# Altium schematic sheet CATS-EUROC-MCU.SchDoc: CATS EuRoC Edition
size A4; DocumentNumber: Overview; Revision: V1.0; SheetNumber: 2; SheetTotal: 16; Author: Luca Jost; Subtitle: Microcontroller
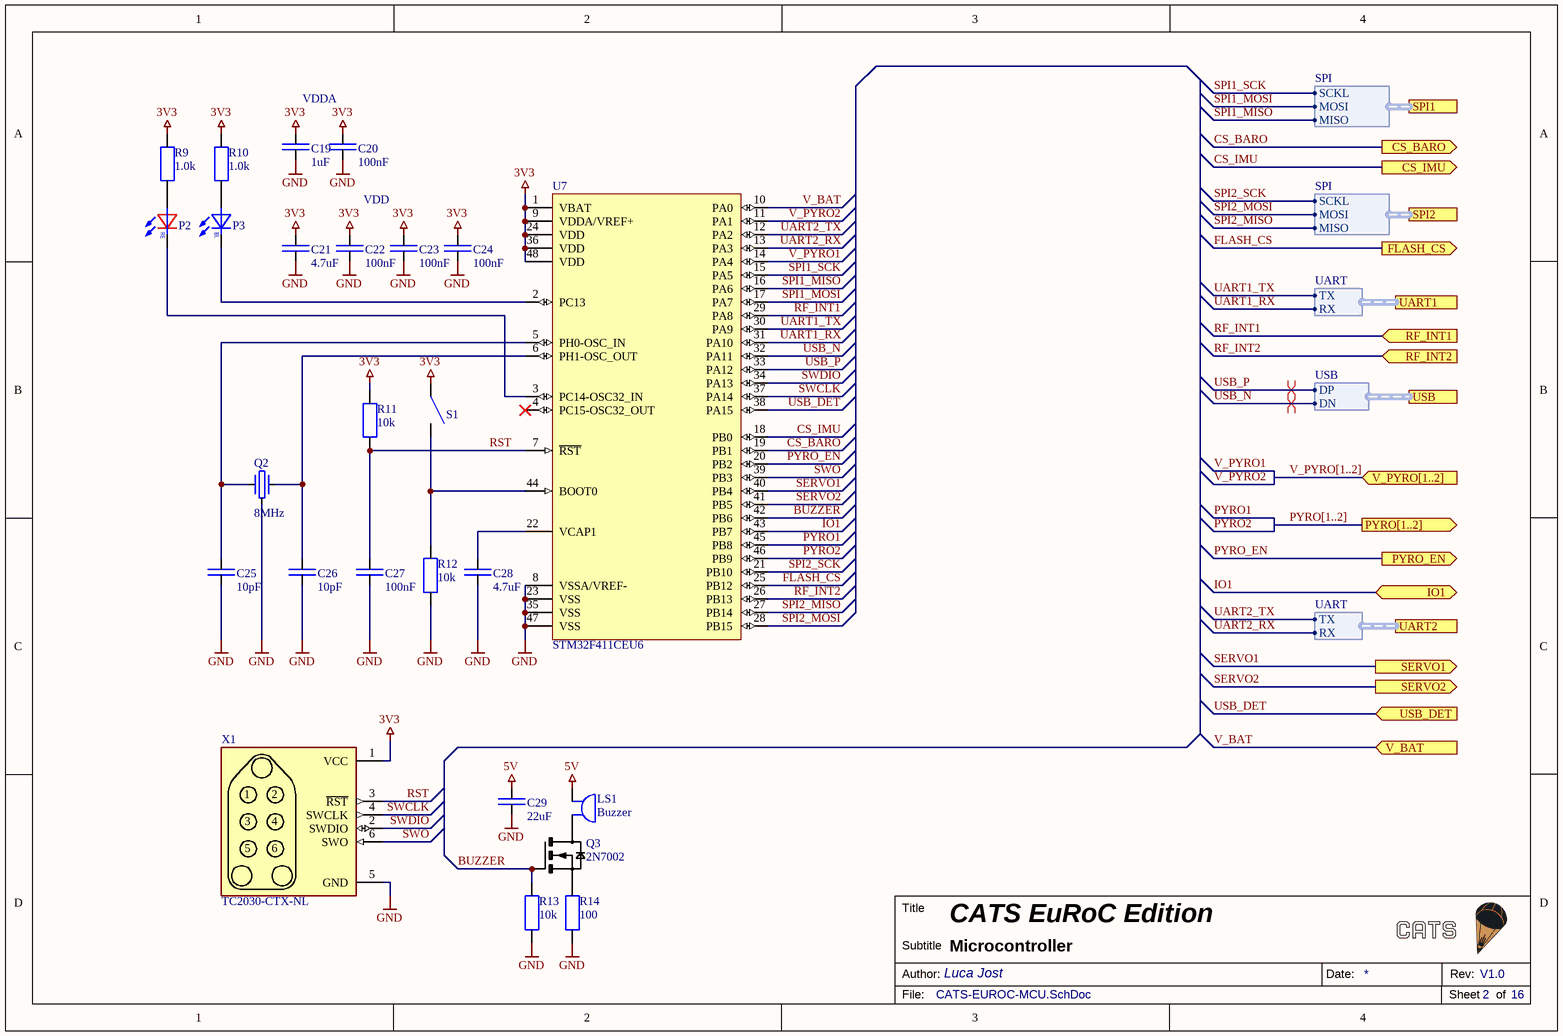
[diagram p0: CATS-EUROC-MCU.SchDoc]

## Parts
C19  1uF  [SMD Keramikkondensator 0402]
C20  100nF  [SMD Keramikkondensator 0402]
C21  4.7uF  [SMD Keramikkondensator 0402]
C22  100nF  [SMD Keramikkondensator 0402]
C23  100nF  [SMD Keramikkondensator 0402]
C24  100nF  [SMD Keramikkondensator 0402]
C25  10pF  [SMD Keramikkondensator 0402]
C26  10pF  [SMD Keramikkondensator 0402]
C27  100nF  [SMD Keramikkondensator 0402]
C28  4.7uF  [SMD Keramikkondensator 0402]
C29  22uF  [SMD Keramikkondensator 0805]
LS1  Buzzer  [SMD BUZZER CMT-8504]
P2  LED  [SMD LED 0603]  (value not drawn)
P3  LED  [SMD LED 0603]  (value not drawn)
Q2  8MHz  [SMD Crystal 3.2X2.5X0.8]
Q3  2N7002  [SMD MOSFET SOT-23]
R9  1.0k  [SMD Widerstand 0402]
R10  1.0k  [SMD Widerstand 0402]
R11  10k  [SMD Widerstand 0402]
R12  10k  [SMD Widerstand 0402]
R13  10k  [SMD Widerstand 0402]
R14  100  [SMD Widerstand 0805]
S1  SMD-Button  [SMD Button 2.5x3x1.2]  (value not drawn)
U7  STM32F411CEU6  [SMD IC QFN-48]
X1  TC2030-CTX-NL  [SMD Connector TC2030]  (no BOM)

## Ports
CS_BARO (out), CS_IMU (out), FLASH_CS (out), IO1 (bidir), PYRO[1..2] (out), PYRO_EN (out), RF_INT1 (in), RF_INT2 (in), SERVO1 (out), SERVO2 (out), SPI1 (harness SPI), SPI2 (harness SPI), UART1 (harness UART), UART2 (harness UART), USB (harness USB), USB_DET (in), V_BAT (in), V_PYRO[1..2] (in)

## Harnesses
SPI: SCKL, MOSI, MISO
UART: TX, RX
USB: DP, DN

## Nets
3V3: C19.2 C20.2 C21.2 C22.2 C23.2 C24.2 R9.2 R10.2 R11.2 S1.1 U7.1(VBAT) U7.9(VDDA/VREF+) U7.24(VDD) U7.36(VDD) U7.48(VDD) X1.1(VCC)
5V: C29.2 LS1.1
GND: C19.1 C20.1 C21.1 C22.1 C23.1 C24.1 C25.1 C26.1 C27.1 C28.1 C29.1 Q2.3 R12.1 R13.1 R14.1 U7.8(VSSA/VREF-) U7.23(VSS) U7.35(VSS) U7.47(VSS) X1.5(GND)
BUZZER: Q3.G R13.2 U7.42(PB6)
CS_BARO: U7.19(PB1) ; port CS_BARO
CS_IMU: U7.18(PB0) ; port CS_IMU
FLASH_CS: U7.25(PB12) ; port FLASH_CS
IO1: U7.43(PB7) ; port IO1
PYRO1: U7.45(PB8)
PYRO2: U7.46(PB9)
PYRO_EN: U7.20(PB2) ; port PYRO_EN
RF_INT1: U7.29(PA8) ; port RF_INT1
RF_INT2: U7.26(PB13) ; port RF_INT2
RST: C27.2 R11.1 U7.7(~{RST}) X1.3(~{RST})
SERVO1: U7.40(PB4) ; port SERVO1
SERVO2: U7.41(PB5) ; port SERVO2
SPI1_MISO: U7.16(PA6) ; port SPI1.MISO
SPI1_MOSI: U7.17(PA7) ; port SPI1.MOSI
SPI1_SCK: U7.15(PA5) ; port SPI1.SCKL
SPI2_MISO: U7.27(PB14) ; port SPI2.MISO
SPI2_MOSI: U7.28(PB15) ; port SPI2.MOSI
SPI2_SCK: U7.21(PB10) ; port SPI2.SCKL
SWCLK: U7.37(PA14) X1.4(SWCLK)
SWDIO: U7.34(PA13) X1.2(SWDIO)
SWO: U7.39(PB3) X1.6(SWO)
UART1_RX: U7.31(PA10) ; port UART1.RX
UART1_TX: U7.30(PA9) ; port UART1.TX
UART2_RX: U7.13(PA3) ; port UART2.RX
UART2_TX: U7.12(PA2) ; port UART2.TX
USB_DET: U7.38(PA15) ; port USB_DET
USB_N: U7.32(PA11) ; port USB.DN
USB_P: U7.33(PA12) ; port USB.DP
V_BAT: U7.10(PA0) ; port V_BAT
V_PYRO1: U7.14(PA4)
V_PYRO2: U7.11(PA1)
NetC25_2: C25.2 Q2.1 U7.5(PH0-OSC_IN)
NetC26_2: C26.2 Q2.2 U7.6(PH1-OSC_OUT)
NetC28_2: C28.2 U7.22(VCAP1)
NetLS1_2: LS1.2 Q3.D
NetP2_A: P2.A R9.1
NetP2_K: P2.K U7.3(PC14-OSC32_IN)
NetP3_A: P3.A R10.1
NetP3_K: P3.K U7.2(PC13)
NetQ3_S: Q3.S R14.2
NetR12_2: R12.2 S1.2 U7.44(BOOT0)

Not connected (* = marked no-connect by the designer): U7 4(PC15-OSC32_OUT)*

## Buses and harness runs
bus PYRO[1..2] = port PYRO[1..2]
bus V_PYRO[1..2] = port V_PYRO[1..2]

## Layout directives
differential pair: USB_N, USB_P

## Notes on the sheet
- VDDA
- VDD
- Title
- Author:
- Subtitle
- Date:
- Rev:
- File:
- Sheet
- of
- (in symbol LED) BL; RE

## Library data of the parts
C19 = E6 - 1uF: SMD Ceramic Capacitor E6; Unit Price: 0.01; Number: -; Supplier: -; JLC: C52923
C20 C22-C24 C27 = E6 - 100nF: SMD Ceramic Capacitor E6; Unit Price: 0.01; Number: -; Supplier: -; JLC: C307331
C21 C28 = E6 - 4.7uF: SMD Ceramic Capacitor E6; Unit Price: 0.01; Number: -; Supplier: -; JLC: C23733
C25 C26 = E6 - 10pF: SMD Ceramic Capacitor E6; Unit Price: 0.01; Number: -; Supplier: -; JLC: C32949
C29 = E6 - 22uF: SMD Ceramic Capacitor E6; Unit Price: 0.01; Number: -; Supplier: -; JLC: C45783
LS1 = Buzzer: Buzzers Indicator, Internally Driven Piezo 12V 10mA 3kHz 100dB @ 12V, 10cm Through Hole PC Pins; Digikey: 2104-IP303012-1-ND; ComponentLink1Description: Datasheet; ComponentLink1URL: https://dbunlimitedco.com/images/product_images/2D-Drawings/IP303012-1.pdf
P2 P3 = LED: Color LED
Q2 = Crystal: SMD Crystal Resonators 8MHz ±10ppm SMD,3.2x2.5mm; Digikey: 535-15255-1-ND; JLC: C2682775
Q3 = 2N7002: MOSFET N-Channel 20V / 115mA; Item Description: N-Channel MOSFET; Digikey: 2N7002NCT-ND; Price: 0.32; ComponentLink1Description: Datasheet; ComponentLink1URL: https://www.onsemi.com/pub/Collateral/NDS7002A-D.PDF; JLC: C15127
R9 R10 = E24 - 1.0k: SMD Chip Resistor E24; Unit Price: 0.01; Number: -; Supplier: -; JLC: C11702
R11-R13 = E24 - 10k: SMD Chip Resistor E24; Unit Price: 0.01; Number: -; Supplier: -; JLC: C25744
R14 = E24 - 100: SMD Chip Resistor E24; Unit Price: 0.01; Number: -; Supplier: -; JLC: C515718
S1 = Button 3mmx2.5mm: Button SPST; Digikey: SW1020TR-ND; JLC: C128937
U7 = STM32F411CEU6: ARM® Cortex®-M4 series Microcontroller IC 32-Bit 100MHz 512KB (512K x 8) FLASH 48-UFQFPN (7x7); Digikey: 497-14907-ND; JLC: C60420; ComponentLink1Description: Datasheet; ComponentLink1URL: https://datasheet.lcsc.com/lcsc/1809291612_STMicroelectronics-STM32F411CEU6_C60420.pdf
X1 = TC2030-CTX-NL: Tag-Connect for ARM-Cortex (6-Pin)